# Altium schematic sheet Lateral_board.schdoc
size 200 x 75 mm
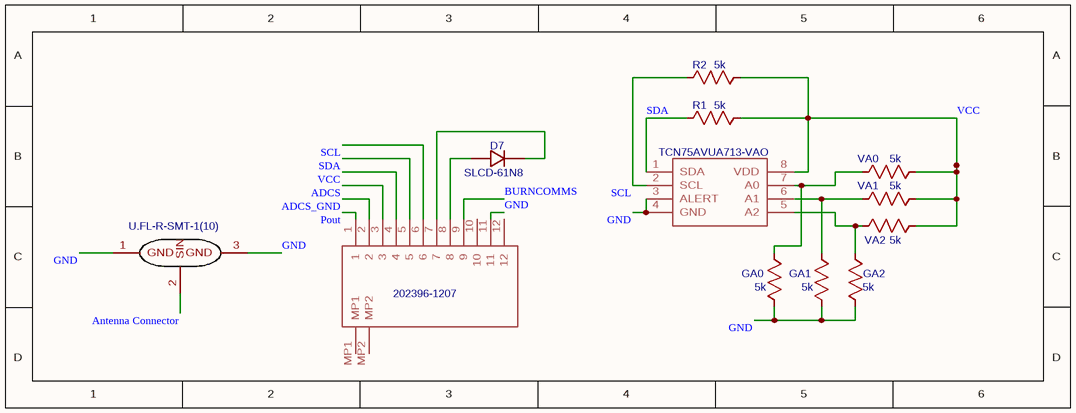
[diagram p0: Lateral_board.schdoc]

## Parts
D7  SLCD-61N8  [SOD-123_L2.8-W1.8-LS3.7-RD]
GA0  5k  [R0805]
GA1  5k  [R0805]
GA2  5k  [R0805]
IC1  TCN75AVUA713-VAO  [SOP65P490X110-8N]
J1  202396-1207  [2023961207]
JP1  U.FL-R-SMT-1(10)  [ANT-SMD_UFL-R-SMT-1-10]
R1  5k  [R0805]
R2  5k  [R0805]
VA0  5k  [R0805]
VA1  5k  [R0805]
VA2  5k  [R0805]

## Nets
ADCS: J1.3
ADCS_GND: J1.2
Antenna Connector: JP1.2(SIN)
BURNCOMMS: J1.9
GND: GA0.1 GA1.1 GA2.1 IC1.3(ALERT) IC1.4(GND) J1.11 JP1.1(GND) JP1.3(GND)
Pout: J1.1
SCL: IC1.2(SCL) J1.6 R2.1
SDA: IC1.1(SDA) J1.5 R1.1
VCC: IC1.8(VDD) J1.4 R1.2 R2.2 VA0.2 VA1.2 VA2.2
NetD7_1: D7.1 J1.7
NetD7_2: D7.2 J1.8
NetGA0_2: GA0.2 IC1.7(A0) VA0.1
NetGA1_2: GA1.2 IC1.6(A1) VA1.1
NetGA2_2: GA2.2 IC1.5(A2) VA2.1

Not connected (* = marked no-connect by the designer): J1 10 12 MP1 MP2

## Library data of the parts
D7 = SLCD-61N8: BOM_Manufacturer: BLUE ROCKET; BOM_Manufacturer Part: 1N4007W; Contributor: Blothr; BOM_Supplier Part: C328592; spicePre: D; spiceSymbolName: SLCD-61N8
GA0-GA2 R1 R2 VA0-VA2 = 5k: BOM_Manufacturer Part: CRCW08055K00JNTA; BOM_Manufacturer: Vishay / Dale; nameAlias: Value(Ω); Contributor: LCEDA_Lib; BOM_Supplier Part: 71-CRCW0805J-5K; BOM_Supplier: Mouser; spicePre: R; spiceSymbolName: R_0603_US; BOM_Link: https://www.mouser.es/ProductDetail/Vishay-Dale/CRCW08055K00JNTA?qs=%2Fha2pyFadui6t5gBae62ocFJ46SNue422n5luvT1xmc7fnXInubqKA%3D%3D
J1 = 202396-1207: Contributor: tomact; spicePre: J; spiceSymbolName: 202396-1207
JP1 = U.FL-R-SMT-1(10): BOM_Manufacturer: HRS; BOM_Supplier: LCSC; BOM_Manufacturer Part: U.FL-R-SMT-1(10); BOM_Supplier Part: C88373; JLCPCB Part Class: Extended Part; BOM_JLCPCB Part Class: Extended Part; spicePre: J; spiceSymbolName: U.FL-R-SMT-1(10)
IC1 = TCN75AVUA713-VAO: spicePre: I; spiceSymbolName: TCN75AVUA713-VAO